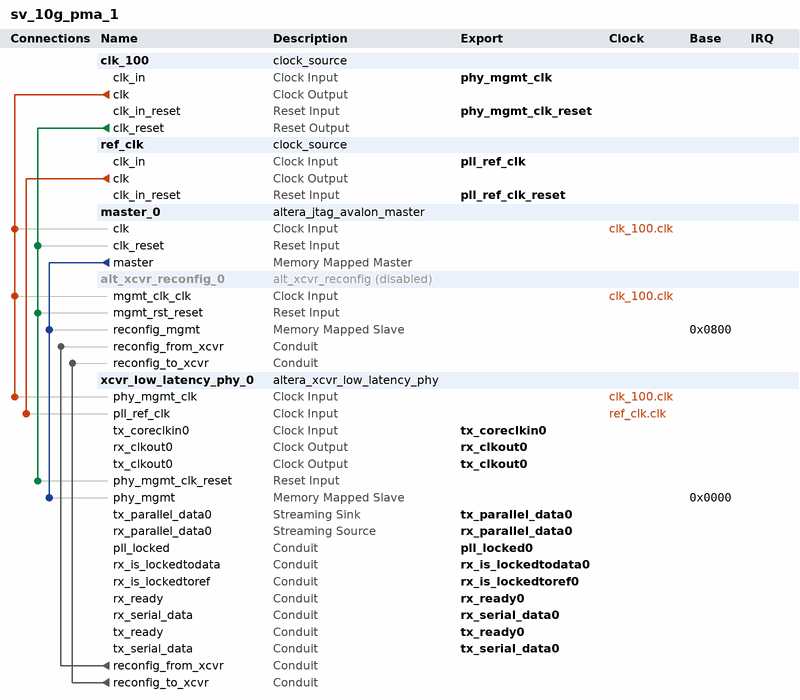
[diagram p0: system contents]
# Platform Designer (Qsys) system sv_10g_pma_1, Stratix V 5SGXEA7N2F45C2
# Parameters at their usual value, and those the tool derives, are not listed.
package require -exact qsys 14.0
create_system sv_10g_pma_1
set_project_property DEVICE_FAMILY {Stratix V}
set_project_property DEVICE 5SGXEA7N2F45C2

add_instance clk_100 clock_source 14.0
set_instance_parameter_value clk_100 clockFrequency 100000000

add_instance ref_clk clock_source 14.0
set_instance_parameter_value ref_clk clockFrequency 644530000

add_instance master_0 altera_jtag_avalon_master 14.0

add_instance alt_xcvr_reconfig_0 alt_xcvr_reconfig 14.0
set_instance_property alt_xcvr_reconfig_0 ENABLED false
set_instance_parameter_value alt_xcvr_reconfig_0 device_family {Stratix V}
set_instance_parameter_value alt_xcvr_reconfig_0 number_of_reconfig_interfaces 2
set_instance_parameter_value alt_xcvr_reconfig_0 gui_split_sizes 2
set_instance_parameter_value alt_xcvr_reconfig_0 enable_analog 1
set_instance_parameter_value alt_xcvr_reconfig_0 enable_eyemon 1
set_instance_parameter_value alt_xcvr_reconfig_0 enable_dfe 1
set_instance_parameter_value alt_xcvr_reconfig_0 enable_adce 1

add_instance xcvr_low_latency_phy_0 altera_xcvr_low_latency_phy 14.0
set_instance_parameter_value xcvr_low_latency_phy_0 device_family {Stratix V}
set_instance_parameter_value xcvr_low_latency_phy_0 intended_device_variant ANY
set_instance_parameter_value xcvr_low_latency_phy_0 gui_data_path_type 10G
set_instance_parameter_value xcvr_low_latency_phy_0 operation_mode DUPLEX
set_instance_parameter_value xcvr_low_latency_phy_0 lanes 1
set_instance_parameter_value xcvr_low_latency_phy_0 gui_bonding_enable 0
set_instance_parameter_value xcvr_low_latency_phy_0 gui_bonded_mode xN
set_instance_parameter_value xcvr_low_latency_phy_0 gui_serialization_factor 66
set_instance_parameter_value xcvr_low_latency_phy_0 gui_pma_width 40
set_instance_parameter_value xcvr_low_latency_phy_0 gui_pll_type CMU
set_instance_parameter_value xcvr_low_latency_phy_0 data_rate {10312.5 Mbps}
set_instance_parameter_value xcvr_low_latency_phy_0 gui_base_data_rate {1250 Mbps}
set_instance_parameter_value xcvr_low_latency_phy_0 gui_pll_refclk_freq {644.53125 MHz}
set_instance_parameter_value xcvr_low_latency_phy_0 gui_select_10g_pcs DEPRECATED
set_instance_parameter_value xcvr_low_latency_phy_0 gui_tx_use_coreclk 1
set_instance_parameter_value xcvr_low_latency_phy_0 gui_rx_use_coreclk 0
set_instance_parameter_value xcvr_low_latency_phy_0 tx_bitslip_enable 0
set_instance_parameter_value xcvr_low_latency_phy_0 rx_bitslip_enable 0
set_instance_parameter_value xcvr_low_latency_phy_0 gui_ppm_det_threshold 100
set_instance_parameter_value xcvr_low_latency_phy_0 gui_enable_att_reset_gate 0
set_instance_parameter_value xcvr_low_latency_phy_0 phase_comp_fifo_mode NONE
set_instance_parameter_value xcvr_low_latency_phy_0 loopback_mode NONE
set_instance_parameter_value xcvr_low_latency_phy_0 use_double_data_mode DEPRECATED
set_instance_parameter_value xcvr_low_latency_phy_0 gxb_analog_power AUTO
set_instance_parameter_value xcvr_low_latency_phy_0 pll_lock_speed AUTO
set_instance_parameter_value xcvr_low_latency_phy_0 tx_analog_power AUTO
set_instance_parameter_value xcvr_low_latency_phy_0 tx_slew_rate OFF
set_instance_parameter_value xcvr_low_latency_phy_0 tx_termination OCT_100_OHMS
set_instance_parameter_value xcvr_low_latency_phy_0 tx_use_external_termination false
set_instance_parameter_value xcvr_low_latency_phy_0 tx_preemp_pretap 0
set_instance_parameter_value xcvr_low_latency_phy_0 gui_tx_preemp_pretap_inv false
set_instance_parameter_value xcvr_low_latency_phy_0 tx_preemp_tap_1 0
set_instance_parameter_value xcvr_low_latency_phy_0 tx_preemp_tap_2 0
set_instance_parameter_value xcvr_low_latency_phy_0 gui_tx_preemp_tap_2_inv false
set_instance_parameter_value xcvr_low_latency_phy_0 tx_vod_selection 2
set_instance_parameter_value xcvr_low_latency_phy_0 tx_common_mode 0.65V
set_instance_parameter_value xcvr_low_latency_phy_0 rx_pll_lock_speed AUTO
set_instance_parameter_value xcvr_low_latency_phy_0 rx_common_mode 0.82V
set_instance_parameter_value xcvr_low_latency_phy_0 rx_termination OCT_100_OHMS
set_instance_parameter_value xcvr_low_latency_phy_0 rx_use_external_termination false
set_instance_parameter_value xcvr_low_latency_phy_0 rx_eq_dc_gain 1
set_instance_parameter_value xcvr_low_latency_phy_0 rx_eq_ctrl 16
set_instance_parameter_value xcvr_low_latency_phy_0 starting_channel_number 0
set_instance_parameter_value xcvr_low_latency_phy_0 en_synce_support 0
set_instance_parameter_value xcvr_low_latency_phy_0 channel_interface 0
set_instance_parameter_value xcvr_low_latency_phy_0 gui_pll_reconfig_enable_pll_reconfig false
set_instance_parameter_value xcvr_low_latency_phy_0 gui_pll_reconfig_pll_count 1
set_instance_parameter_value xcvr_low_latency_phy_0 gui_pll_reconfig_refclk_count 1
set_instance_parameter_value xcvr_low_latency_phy_0 gui_pll_reconfig_main_pll_index 0
set_instance_parameter_value xcvr_low_latency_phy_0 gui_pll_reconfig_cdr_pll_refclk_sel 0
set_instance_parameter_value xcvr_low_latency_phy_0 gui_pll_reconfig_pll0_pll_type CMU
set_instance_parameter_value xcvr_low_latency_phy_0 gui_pll_reconfig_pll0_data_rate {0 Mbps}
set_instance_parameter_value xcvr_low_latency_phy_0 gui_pll_reconfig_pll0_refclk_freq {0 MHz}
set_instance_parameter_value xcvr_low_latency_phy_0 gui_pll_reconfig_pll0_refclk_sel 0
set_instance_parameter_value xcvr_low_latency_phy_0 gui_pll_reconfig_pll0_clk_network x1
set_instance_parameter_value xcvr_low_latency_phy_0 gui_pll_reconfig_pll1_pll_type CMU
set_instance_parameter_value xcvr_low_latency_phy_0 gui_pll_reconfig_pll1_data_rate {0 Mbps}
set_instance_parameter_value xcvr_low_latency_phy_0 gui_pll_reconfig_pll1_refclk_freq {0 MHz}
set_instance_parameter_value xcvr_low_latency_phy_0 gui_pll_reconfig_pll1_refclk_sel 0
set_instance_parameter_value xcvr_low_latency_phy_0 gui_pll_reconfig_pll1_clk_network x1
set_instance_parameter_value xcvr_low_latency_phy_0 gui_pll_reconfig_pll2_pll_type CMU
set_instance_parameter_value xcvr_low_latency_phy_0 gui_pll_reconfig_pll2_data_rate {0 Mbps}
set_instance_parameter_value xcvr_low_latency_phy_0 gui_pll_reconfig_pll2_refclk_freq {0 MHz}
set_instance_parameter_value xcvr_low_latency_phy_0 gui_pll_reconfig_pll2_refclk_sel 0
set_instance_parameter_value xcvr_low_latency_phy_0 gui_pll_reconfig_pll2_clk_network x1
set_instance_parameter_value xcvr_low_latency_phy_0 gui_pll_reconfig_pll3_pll_type CMU
set_instance_parameter_value xcvr_low_latency_phy_0 gui_pll_reconfig_pll3_data_rate {0 Mbps}
set_instance_parameter_value xcvr_low_latency_phy_0 gui_pll_reconfig_pll3_refclk_freq {0 MHz}
set_instance_parameter_value xcvr_low_latency_phy_0 gui_pll_reconfig_pll3_refclk_sel 0
set_instance_parameter_value xcvr_low_latency_phy_0 gui_pll_reconfig_pll3_clk_network x1
set_instance_parameter_value xcvr_low_latency_phy_0 gui_mgmt_clk_in_hz 150000000
set_instance_parameter_value xcvr_low_latency_phy_0 gui_embedded_reset 1
set_instance_parameter_value xcvr_low_latency_phy_0 gui_split_interfaces 1
set_instance_parameter_value xcvr_low_latency_phy_0 gui_avalon_symbol_size 0

# connections
add_connection clk_100.clk alt_xcvr_reconfig_0.mgmt_clk_clk clock
add_connection clk_100.clk master_0.clk clock
add_connection clk_100.clk xcvr_low_latency_phy_0.phy_mgmt_clk clock
add_connection ref_clk.clk xcvr_low_latency_phy_0.pll_ref_clk clock
add_connection clk_100.clk_reset alt_xcvr_reconfig_0.mgmt_rst_reset reset
add_connection clk_100.clk_reset master_0.clk_reset reset
add_connection clk_100.clk_reset xcvr_low_latency_phy_0.phy_mgmt_clk_reset reset
add_connection master_0.master alt_xcvr_reconfig_0.reconfig_mgmt avalon
set_connection_parameter_value master_0.master/alt_xcvr_reconfig_0.reconfig_mgmt baseAddress 0x0800
add_connection master_0.master xcvr_low_latency_phy_0.phy_mgmt avalon
set_connection_parameter_value master_0.master/xcvr_low_latency_phy_0.phy_mgmt baseAddress 0x0000
add_connection xcvr_low_latency_phy_0.reconfig_from_xcvr alt_xcvr_reconfig_0.reconfig_from_xcvr conduit
add_connection xcvr_low_latency_phy_0.reconfig_to_xcvr alt_xcvr_reconfig_0.reconfig_to_xcvr conduit

# exported interfaces
add_interface phy_mgmt_clk clock sink
set_interface_property phy_mgmt_clk EXPORT_OF clk_100.clk_in
add_interface phy_mgmt_clk_reset reset sink
set_interface_property phy_mgmt_clk_reset EXPORT_OF clk_100.clk_in_reset
add_interface pll_ref_clk clock sink
set_interface_property pll_ref_clk EXPORT_OF ref_clk.clk_in
add_interface pll_ref_clk_reset reset sink
set_interface_property pll_ref_clk_reset EXPORT_OF ref_clk.clk_in_reset
add_interface tx_ready0 conduit end
set_interface_property tx_ready0 EXPORT_OF xcvr_low_latency_phy_0.tx_ready
add_interface rx_ready0 conduit end
set_interface_property rx_ready0 EXPORT_OF xcvr_low_latency_phy_0.rx_ready
add_interface tx_serial_data0 conduit end
set_interface_property tx_serial_data0 EXPORT_OF xcvr_low_latency_phy_0.tx_serial_data
add_interface pll_locked0 conduit end
set_interface_property pll_locked0 EXPORT_OF xcvr_low_latency_phy_0.pll_locked
add_interface rx_serial_data0 conduit end
set_interface_property rx_serial_data0 EXPORT_OF xcvr_low_latency_phy_0.rx_serial_data
add_interface rx_parallel_data0 avalon_streaming source
set_interface_property rx_parallel_data0 EXPORT_OF xcvr_low_latency_phy_0.rx_parallel_data0
add_interface tx_parallel_data0 avalon_streaming sink
set_interface_property tx_parallel_data0 EXPORT_OF xcvr_low_latency_phy_0.tx_parallel_data0
add_interface rx_clkout0 clock source
set_interface_property rx_clkout0 EXPORT_OF xcvr_low_latency_phy_0.rx_clkout0
add_interface rx_is_lockedtodata0 conduit end
set_interface_property rx_is_lockedtodata0 EXPORT_OF xcvr_low_latency_phy_0.rx_is_lockedtodata
add_interface rx_is_lockedtoref0 conduit end
set_interface_property rx_is_lockedtoref0 EXPORT_OF xcvr_low_latency_phy_0.rx_is_lockedtoref
add_interface tx_clkout0 clock source
set_interface_property tx_clkout0 EXPORT_OF xcvr_low_latency_phy_0.tx_clkout0
add_interface tx_coreclkin0 clock sink
set_interface_property tx_coreclkin0 EXPORT_OF xcvr_low_latency_phy_0.tx_coreclkin0

set_interconnect_requirement {$system} qsys_mm.clockCrossingAdapter HANDSHAKE
set_interconnect_requirement {$system} qsys_mm.maxAdditionalLatency 1

save_system sv_10g_pma_1.qsys
